# EAGLE design mc (EAGLE 9.6.2)
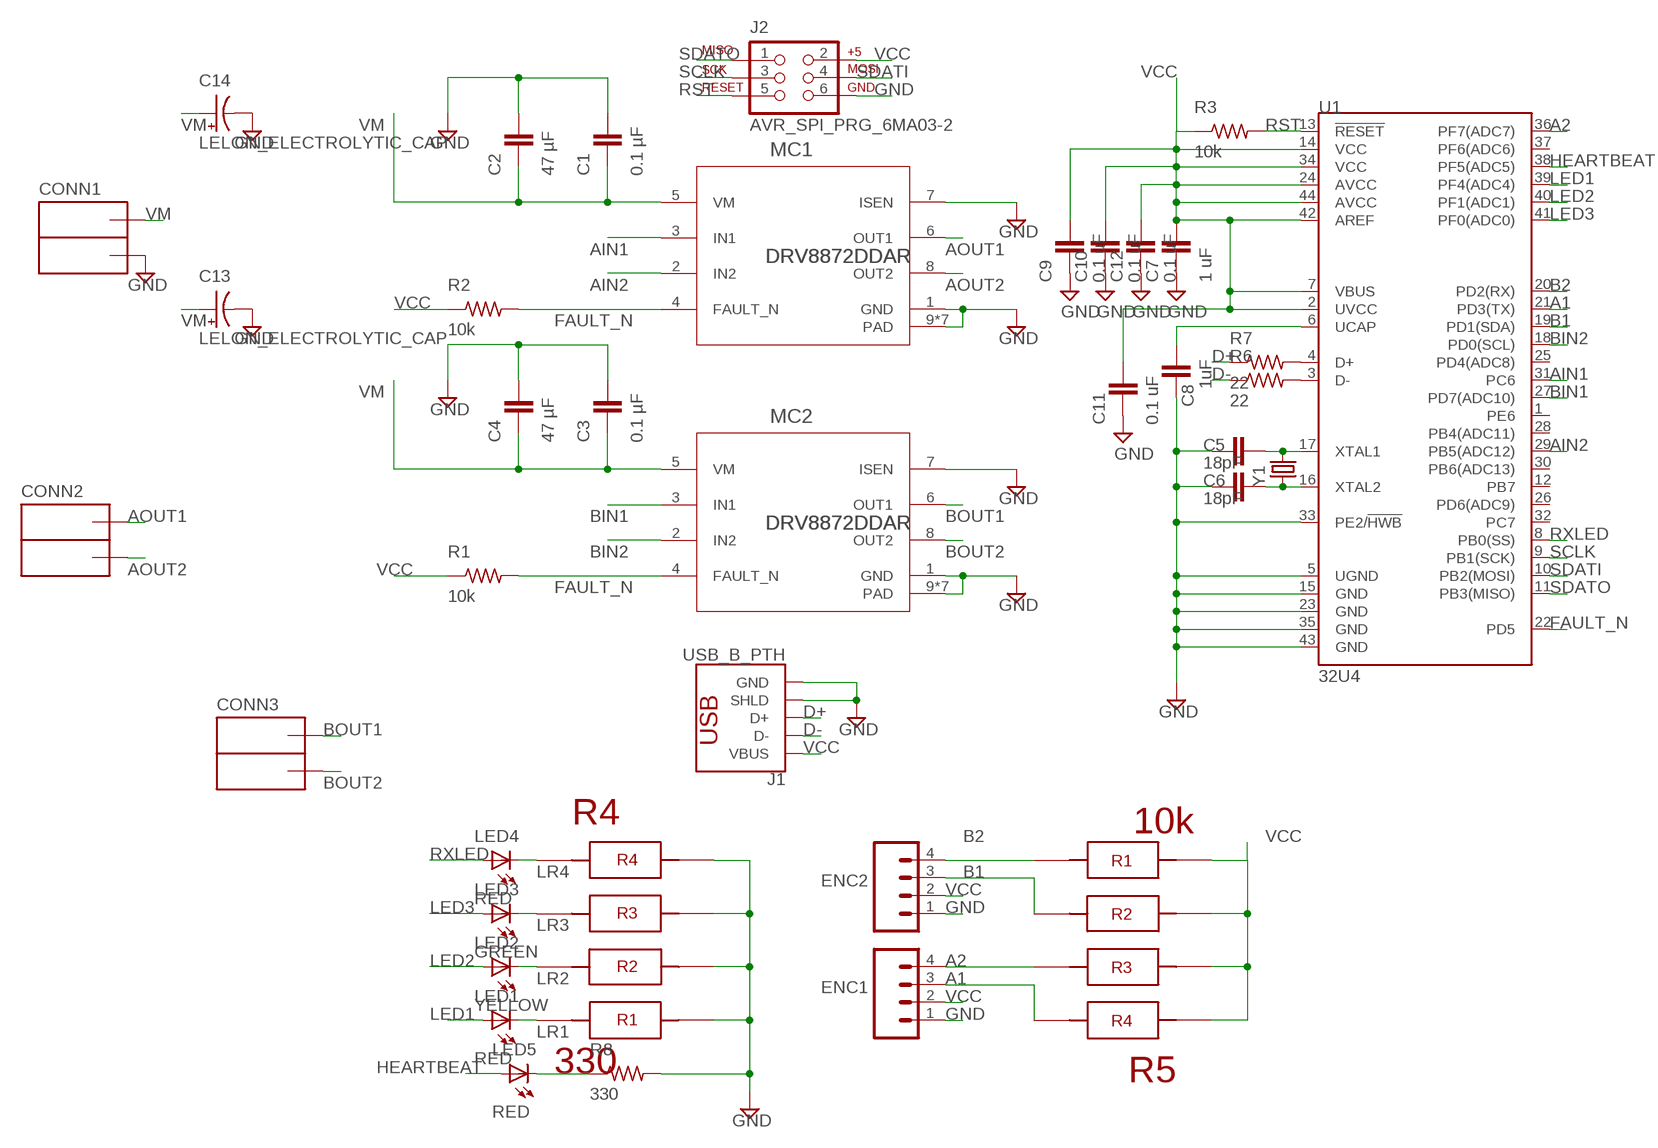
[diagram p0: schematic, sheet 1]

## Parts
C1  0.1 µF  CAP0603-CAP  [0603-CAP]
C2  47 µF  CAP1206  [1206]
C3  0.1 µF  CAP0603-CAP  [0603-CAP]
C4  47 µF  CAP1206  [1206]
C5  18pF  CAP0603-CAP  [0603-CAP]
C6  18pF  CAP0603-CAP  [0603-CAP]
C7  1 uF  CAP0603-CAP  [0603-CAP]
C8  1uF  CAP0603-CAP  [0603-CAP]
C9  0.1 uF  CAP0402-CAP  [0402-CAP]
C10  0.1 uF  CAP0402-CAP  [0402-CAP]
C11  0.1 uF  CAP0402-CAP  [0402-CAP]
C12  0.1 uF  CAP0402-CAP  [0402-CAP]
C13  LELON_ELECTROLYTIC_CAP  [LELON_CAP]
C14  LELON_ELECTROLYTIC_CAP  [LELON_CAP]
CONN1  ANDERSONVERTICAL  [ANDERSON_VERTICAL]
CONN2  ANDERSONVERTICAL  [ANDERSON_VERTICAL]
CONN3  ANDERSONVERTICAL  [ANDERSON_VERTICAL]
ENC1  M041X04-MTA  [1X04-MTA]
ENC2  M041X04-MTA  [1X04-MTA]
J1  USB_B_PTH  [USB-B-PTH]
J2  AVR_SPI_PRG_6MA03-2  [MA03-2]
LED1  RED  LED0805  [LED-0805]
LED2  YELLOW  LED0805  [LED-0805]
LED3  GREEN  LED0805  [LED-0805]
LED4  RED  LED0805  [LED-0805]
LED5  RED  LED0805  [LED-0805]
MC1  DRV8872DDAR  [DDA0008H_N_TEX]
MC2  DRV8872DDAR  [DDA0008H_N_TEX]
R1  10k  R-US_R0603  [R0603]
R2  10k  R-US_R0603  [R0603]
R3  10k  R-US_R0603  [R0603]
R4  330  4X-0603  [4X-0603]
R5  10k  4X-0603  [4X-0603]
R6  22  R-US_R0603  [R0603]
R7  22  R-US_R0603  [R0603]
R8  330  R-US_R0603  [R0603]
U1  32U4  ATMEGA32U4QFN  [QFN-44]
Y1  CRYSTAL  [CRYSTAL-SMD-5.0X3.2-2PIN]

## Nets
A1: ENC1.3 R5.4 U1.21(PD3(TX))
A2: ENC1.4 R5.3 U1.36(PF7(ADC7))
AIN1: MC1.3(IN1) U1.31(PC6)
AIN2: MC1.2(IN2) U1.29(PB5(ADC12))
AOUT1: CONN2.PIN2(OUTA) MC1.6(OUT1)
AOUT2: CONN2.PIN1(OUTB) MC1.8(OUT2)
B1: ENC2.3 R5.2 U1.19(PD1(SDA))
B2: ENC2.4 R5.1 U1.20(PD2(RX))
BIN1: MC2.3(IN1) U1.27(PD7(ADC10))
BIN2: MC2.2(IN2) U1.18(PD0(SCL))
BOUT1: CONN3.PIN2(OUTA) MC2.6(OUT1)
BOUT2: CONN3.PIN1(OUTB) MC2.8(OUT2)
D+: J1.D+ R7.1
D-: J1.D- R6.1
FAULT_N: MC1.4(FAULT_N) MC2.4(FAULT_N) R1.2 R2.2 U1.22(PD5)
GND: C1.2 C2.2 C3.2 C4.2 C5.1 C6.1 C7.1 C8.1 C9.1 C10.1 C11.1 C12.1 C13.P$2(-) C14.P$2(-) CONN1.PIN1(OUTB) ENC1.1 ENC2.1 J1.GND J1.SHLD1(SHLD) J1.SHLD2(SHLD) J2.6 MC1.1(GND) MC1.7(ISEN) MC1.9(PAD) MC1.P$1(PAD) MC1.P$2(PAD) MC1.P$3(PAD) MC1.P$4(PAD) MC1.P$5(PAD) MC1.P$6(PAD) MC2.1(GND) MC2.7(ISEN) MC2.9(PAD) MC2.P$1(PAD) MC2.P$2(PAD) MC2.P$3(PAD) MC2.P$4(PAD) MC2.P$5(PAD) MC2.P$6(PAD) R4.1 R4.2 R4.3 R4.4 R8.2 U1.5(UGND) U1.15(GND) U1.23(GND) U1.33(PE2/!HWB) U1.35(GND) U1.43(GND)
HEARTBEAT: LED5.A U1.38(PF5(ADC5))
LED1: LED1.A U1.39(PF4(ADC4))
LED2: LED2.A U1.40(PF1(ADC1))
LED3: LED3.A U1.41(PF0(ADC0))
LR1: LED1.C R4.8
LR2: LED2.C R4.7
LR3: LED3.C R4.6
LR4: LED4.C R4.5
N$1: C8.2 U1.6(UCAP)
N$3: C5.2 U1.17(XTAL1) Y1.P$2
N$6: R6.2 U1.3(D-)
N$9: R7.2 U1.4(D+)
N$10: LED5.C R8.1
N$13: C6.2 U1.16(XTAL2) Y1.P$1
RST: J2.5 R3.2 U1.13(!RESET)
RXLED: LED4.A U1.8(PB0(SS))
SCLK: J2.3 U1.9(PB1(SCK))
SDATI: J2.4 U1.10(PB2(MOSI))
SDATO: J2.1 U1.11(PB3(MISO))
VCC: C7.2 C9.2 C10.2 C11.2 C12.2 ENC1.2 ENC2.2 J1.VBUS J2.2 R1.1 R2.1 R3.1 R5.5 R5.6 R5.7 R5.8 U1.2(UVCC) U1.7(VBUS) U1.14(VCC) U1.24(AVCC) U1.34(VCC) U1.42(AREF) U1.44(AVCC)
VM: C1.1 C2.1 C3.1 C4.1 C13.P$1(+) C14.P$1(+) CONN1.PIN2(OUTA) MC1.5(VM) MC2.5(VM)
Unconnected: U1.1(PE6) U1.12(PB7) U1.25(PD4(ADC8)) U1.26(PD6(ADC9)) U1.28(PB4(ADC11)) U1.30(PB6(ADC13)) U1.32(PC7) U1.37(PF6(ADC6))

## Library data of the parts
C1 C3 C5-C12 = pie:CAP: Capacitor Standard 0603 ceramic capacitor, and 0.1" leaded capacitor.; PIE-INT-REF-NUM: CAPACITOR-GENERIC
C2 C4 = pie:CAP: Capacitor Standard 0603 ceramic capacitor, and 0.1" leaded capacitor.
C13 C14 = pie:LELON_ELECTROLYTIC_CAP
CONN1-CONN3 = pie:ANDERSON: 2-pin 25A Anderson Connector http://www.alliedelec.com/images/products/datasheets/bm/ANDERSON_POWER_PRODUCTS/70162018.pdf; PIE-INT-REF-NUM: Anderson
ENC1 ENC2 = pie:M04: 4-pin 0.1-inch header and MTA connector; PIE-INT-REF-NUM: MTA
J1 = pie:USB_B: USB Type B Connector SparkFun Products: SparkFun Stepoko <https://www.sparkfun.com/products/13899> PTH; PROD_ID: CONN-08278; SF_ID: PRT-00139
J2 = pie:AVR_SPI_PRG_6: AVR ISP 6 Pin This is the reduced ISP connector for AVR programming. Common on Arduino. This footprint will take up less PCB space and can be used with a 10-pin to 6-pin adapter such as SKU: BOB-08508; PIE-INT-REF-NUM: BULK-STOCK
LED1-LED5 = pie:LED: LEDs Standard schematic elements and footprints for 5mm, 3mm, 1206, and 0603 sized LEDs. 5mm - Spark Fun Electronics SKU : COM-00529 (and others); PIE-INT-REF-NUM: LED
MC1 MC2 = pie:DRV8872DDAR; BUILT_BY: Texas_Instrument_Team; MANUFACTURER_PART_NUMBER: DRV8872DDAR; SOURCELIBRARY: TI_2019-01-17; VENDOR: Texas Instruments
R1-R3 R6-R8 = pie:R-US_: RESISTOR, American symbol; DESCRIPTION: RESISTOR, American symbol; DISTRIBUTOR: DigiKey; MANUFACTURER: Rohm Semiconductor; NOTES: Cut Tape; PACKAGE: R0603; VALUE: >VALUE
R4 R5 = pie:4X-0603: 330: https://www.digikey.com/product-detail/en/panasonic-electronic-components/EXB-38V331JV/Y9331CT-ND/256586 10k: https://www.digikey.com/product-detail/en/panasonic-electronic-components/EXB-38V103JV/Y9103CT-ND/256604
U1 = pie:ATMEGA32U4: Atmel MCU, 32KByte Atmel 44-pin 8-bit Microcontroller with 32KBytes of ISP Flash and USB Controller Datasheet <http://cdn.sparkfun.com/datasheets/Dev/Arduino/Boards/ATMega32U4.pdf> SparkFun Products LilyPad Arduino USB - ATmega32U4 Board <https://www.sparkfun.com/products/12049> (DEV-12049) Pro Micro - 5V/16MHz <https://www.sparkfun.com/products/12640> (DEV-12640) Pro Micro - 3.3V/8MHz <https://www.sparkfun.com/products/12587> (DEV-12587) Fio v3 - ATmega32U4 <https://www.sparkfun.com/products/11520> (DEV-11520) Qduino Mini <https://www.sparkfun.com/products/13614> (DEV-13614) Makey Makey - Standard Kit <https://www.sparkfun.com/products/11511> (WIG-11511) Makey Makey Deluxe Kit <https://www.sparkfun.com/products/11519> (WIG-11519); PROD_ID: IC-10828
Y1 = pie:CRYSTAL: Various standard crystals. Proven footprints. Spark Fun Electronics SKU : COM-00534

## Board
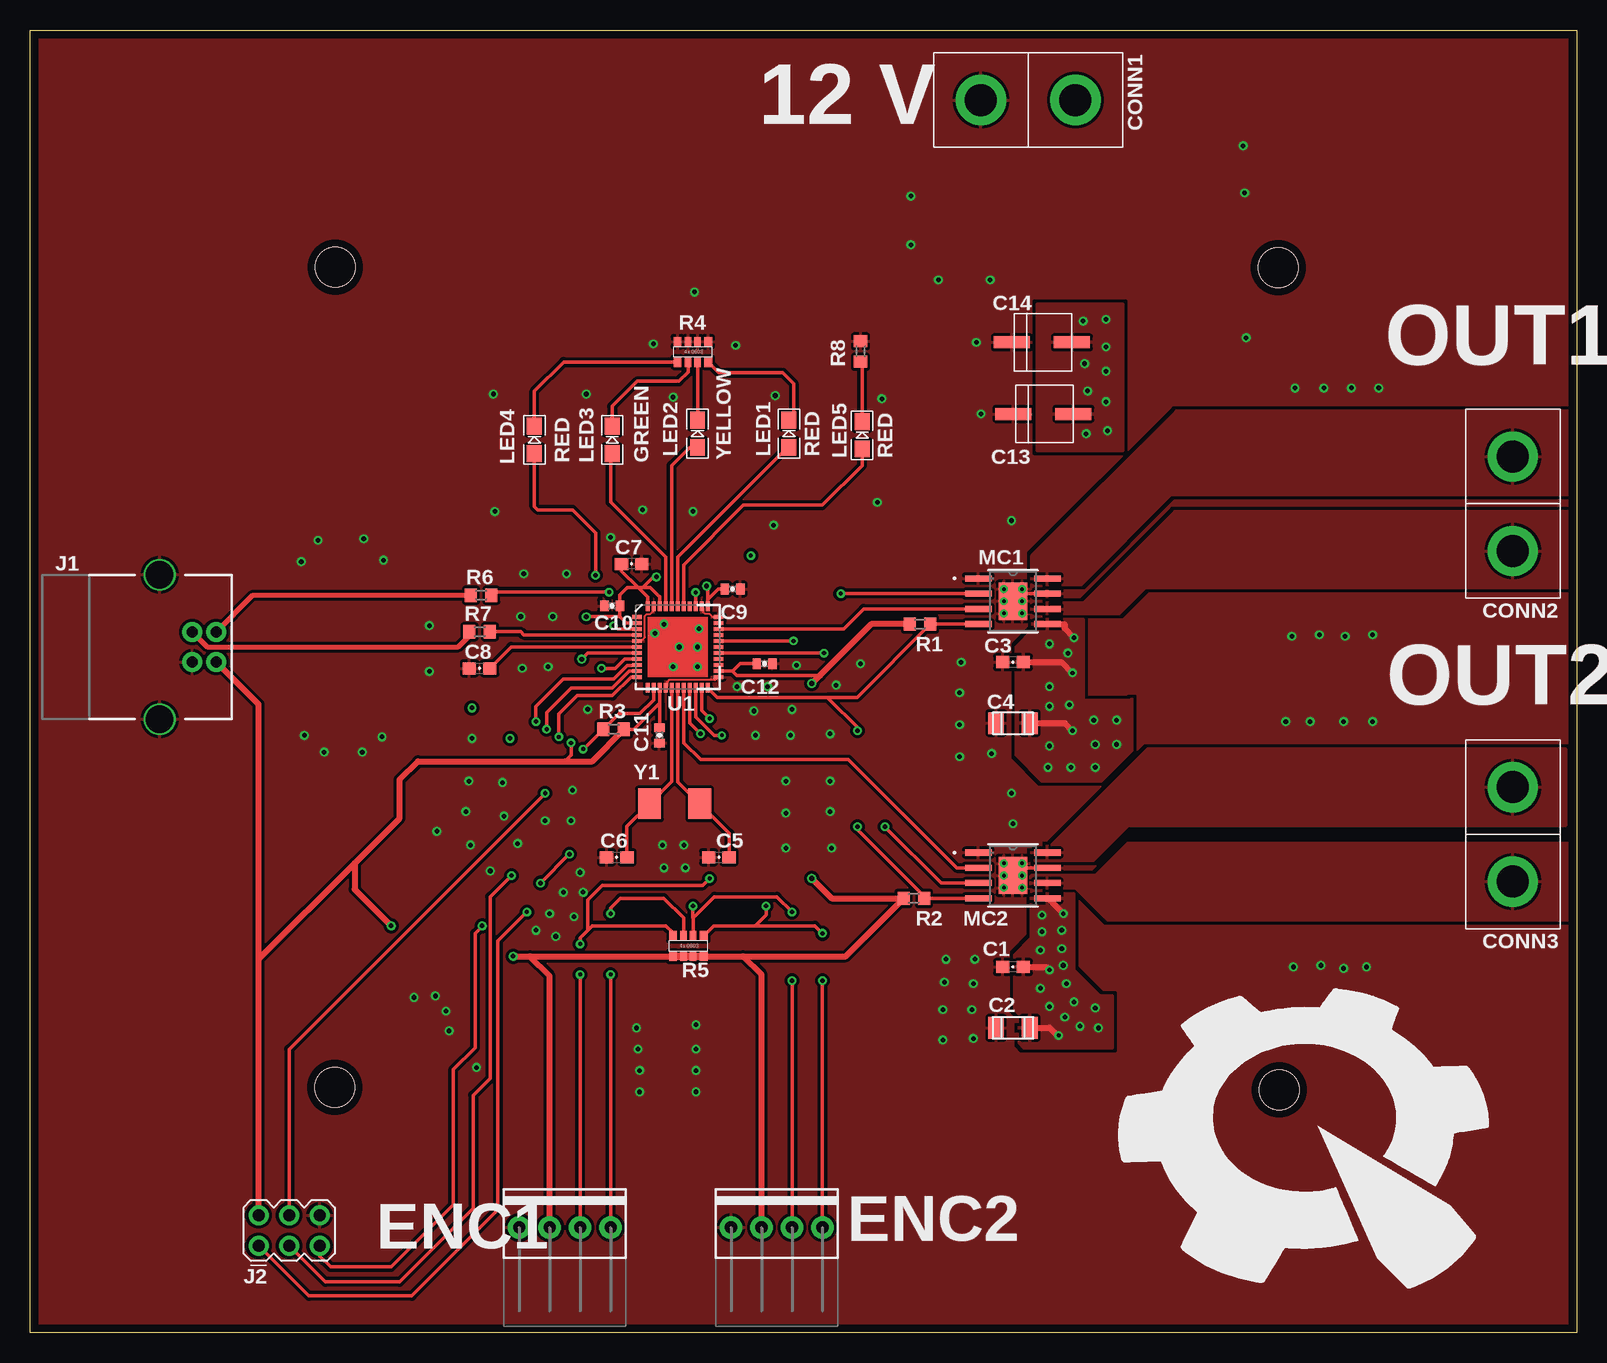
[diagram p1: board, top side]
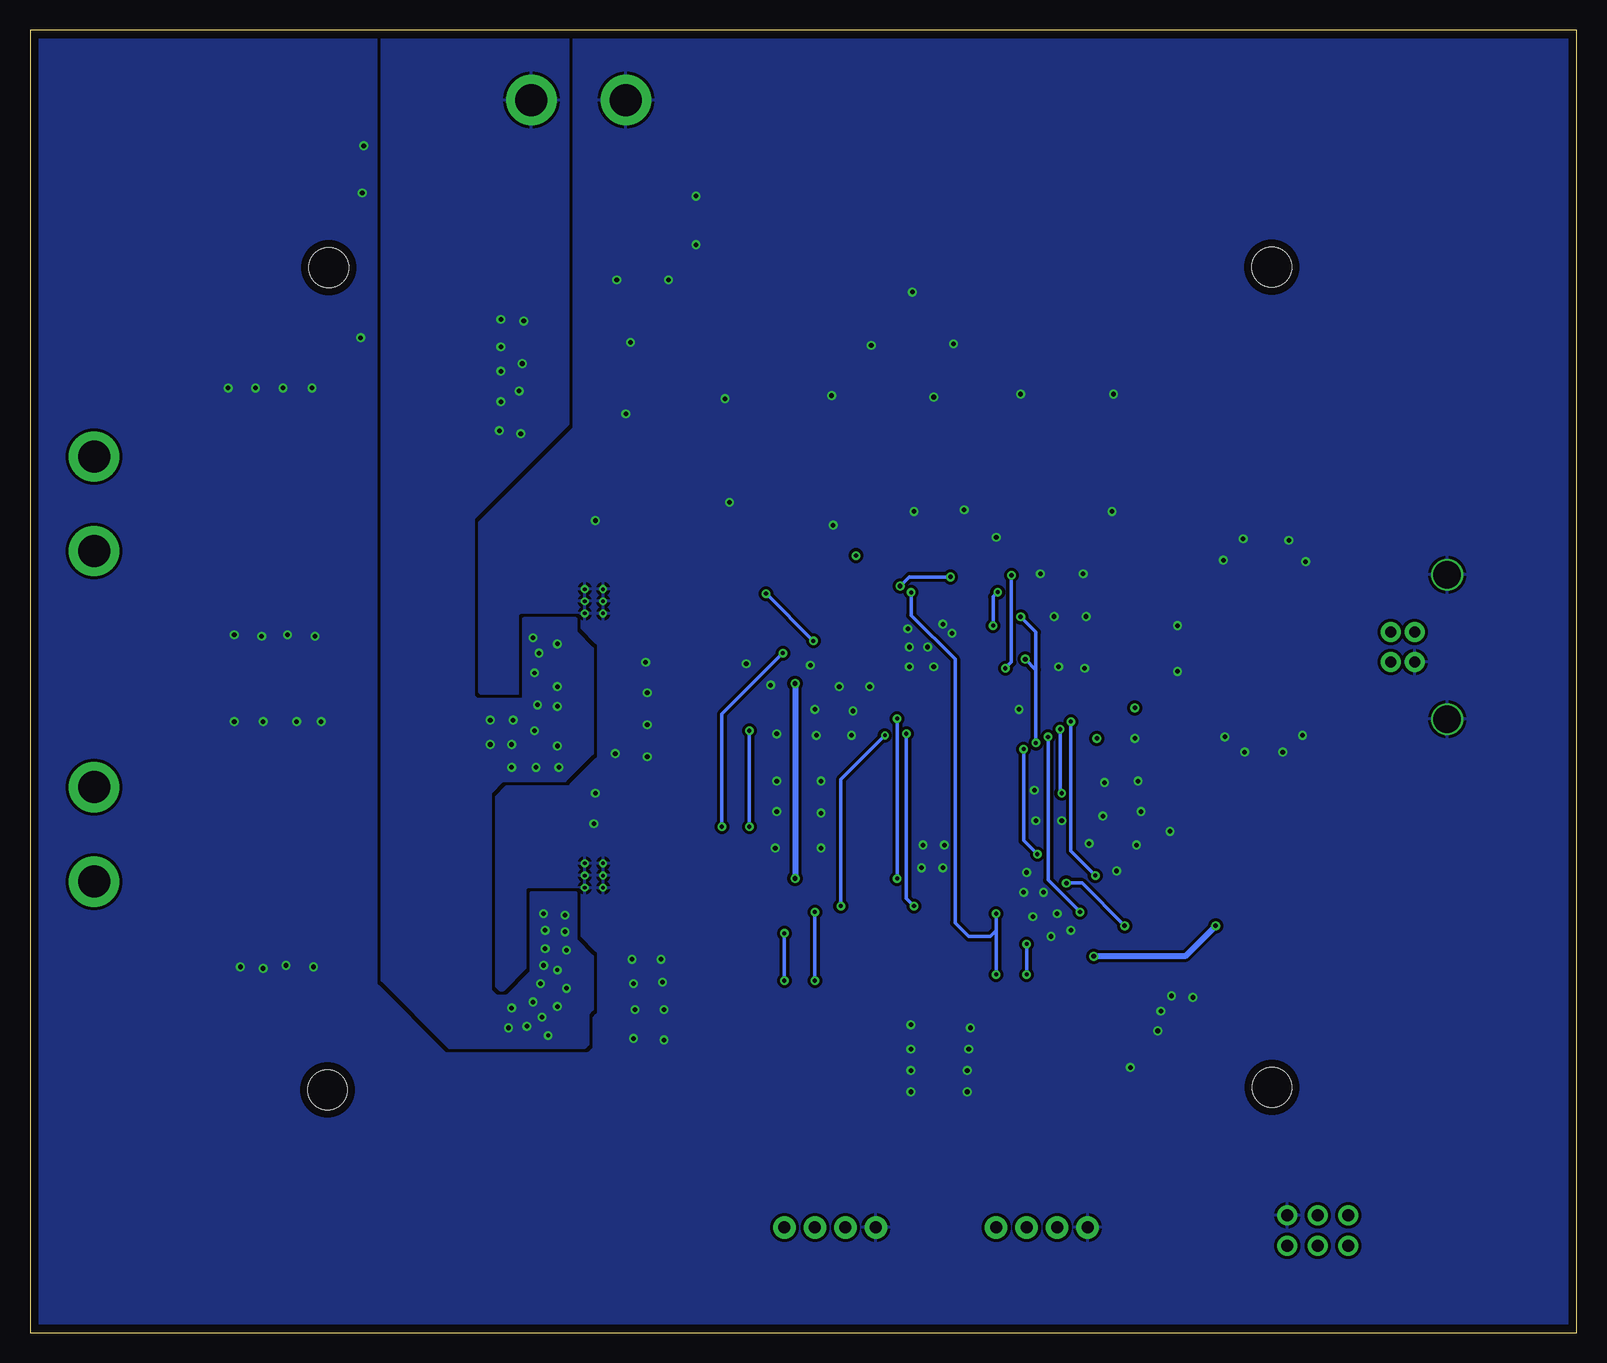
[diagram p2: board, bottom side, seen from below]

Size 128.91 x 108.58 mm. Coordinates in mm from the lower left corner, seen from the top.
Outline: 128.91,108.58 128.91,0 0,0 0,108.58 128.91,108.58
Copper layers (1*16): Top 2mil / dielectric 9mil / Bottom 2mil
Design rules "pie_jlc": minimum track width 6mil, minimum drill 0.199896875mm, track to track 6mil, track to pad 6mil, pad to pad 6mil, via to via 6mil, smd to smd 6mil, copper to edge 25mil, drill to drill 7mil, minimum pad ring 7mil, minimum via ring 7mil, stop-mask expansion 3mil, vias tented up to drill 21mil, thermal gap 10mil

### Footprints (pad centres in the part's own frame; a part is rotated, then mirrored left to right if it is on the bottom)
0603-CAP = smd 1.1 x 1: 1 -0.85,0; 2 0.85,0
1206 = smd 1.306 x 1.8: 1 -1.403,0; 2 1.403,0
0402-CAP = smd 0.7 x 0.9: 1 -0.65,0; 2 0.65,0
LELON_CAP = smd 3 x 1: P$1 -3,0; P$2 2,0
ANDERSON_VERTICAL = drill 2.667 pad 4.191: PIN1 0,-3.937; PIN2 0,3.937
1X04-MTA = drill 1.016 pad 1.88: 1 -3.81,0; 2 -1.27,0; 3 1.27,0; 4 3.81,0
USB-B-PTH = drill 0.914 pad 1.676: D+ 4,1.25; D- 5.981,1.25; GND 4,-1.25; VBUS 5.981,-1.25 | drill 2.286: SHLD1 1.282,-6.02; SHLD2 1.282,6.02
MA03-2 = drill 1 pad 1.676: 1 -2.54,-1.27; 2 -2.54,1.27; 3 0,-1.27; 4 0,1.27; 5 2.54,-1.27; 6 2.54,1.27
LED-0805 = smd 1.397 x 1.245: A -1.143,0; C 1.143,0
DDA0008H_N_TEX = smd 2.21 x 0.508: 1 -2.875,1.905; 2 -2.875,0.635; 3 -2.875,-0.635; 4 -2.875,-1.905; 5 2.875,-1.905; 6 2.875,-0.635; 7 2.875,0.635; 8 2.875,1.905 | smd 2.388 x 3.099: 9 0,0 | drill 0.3: P$1 -0.762,1.016; P$2 0.762,1.016; P$3 -0.762,0; P$4 0.762,0; P$5 -0.762,-1.016; P$6 0.762,-1.016
R0603 = smd 1 x 1.1: 1 -0.85,0; 2 0.85,0
4X-0603 = smd 0.65 x 0.8: 1 0,-0.05; 4 2.55,-0.05; 5 2.55,1.65; 8 0,1.65 | smd 0.55 x 0.8: 2 0.875,-0.05; 3 1.675,-0.05; 6 1.675,1.65; 7 0.875,1.65
QFN-44 = smd 0.8 x 0.3: 1 -3.4,2.5; 2 -3.4,2; 3 -3.4,1.5; 4 -3.4,1; 5 -3.4,0.5; 6 -3.4,0; 7 -3.4,-0.5; 8 -3.4,-1; 9 -3.4,-1.5; 10 -3.4,-2; 11 -3.4,-2.5; 23 3.4,-2.5; 24 3.4,-2; 25 3.4,-1.5; 26 3.4,-1; 27 3.4,-0.5; 28 3.4,0; 29 3.4,0.5; 30 3.4,1; 31 3.4,1.5; 32 3.4,2; 33 3.4,2.5 | smd 0.3 x 0.8: 12 -2.5,-3.4; 13 -2,-3.4; 14 -1.5,-3.4; 15 -1,-3.4; 16 -0.5,-3.4; 17 0,-3.4; 18 0.5,-3.4; 19 1,-3.4; 20 1.5,-3.4; 21 2,-3.4; 22 2.5,-3.4; 34 2.5,3.4; 35 2,3.4; 36 1.5,3.4; 37 1,3.4; 38 0.5,3.4; 39 0,3.4; 40 -0.5,3.4; 41 -1,3.4; 42 -1.5,3.4; 43 -2,3.4; 44 -2.5,3.4
STAND-OFF = hole 3.302: 0,0
CRYSTAL-SMD-5.0X3.2-2PIN = smd 1.905 x 2.54: P$1 -2.095,0; P$2 2.095,0

### Placement (x,y rotation side)
C1  81.92,30.48 180 top
C2  81.92,25.4 180 top
C3  81.92,55.88 180 top
C4  81.92,50.8 180 top
C5  57.4,39.62 0 top
C6  48.9,39.62 0 top
C7  50.14,64.08 180 top
C8  37.47,55.37 0 top
C9  58.55,61.98 180 top
C10  48.51,60.58 0 top
C11  52.45,49.78 90 top
C12  61.21,55.75 180 top
C13  83.95,76.58 180 top
C14  83.82,82.55 180 top
CONN1  83.19,102.74 270 top
CONN2  123.57,69.09 180 top
CONN3  123.57,41.53 180 top
ENC1  44.58,8.76 0 top
ENC2  62.23,8.76 0 top
J1  9.53,57.15 0 top
J2  21.59,8.51 0 top
LED1  63.25,74.93 90 top
LED2  55.63,74.93 90 top
LED3  48.51,74.42 90 top
LED4  42.04,74.42 90 top
LED5  69.34,74.8 90 top
MC1  81.92,60.96 0 top
MC2  81.92,38.1 0 top
R1  74.17,59.05 0 top
R2  73.66,36.2 0 top
R3  48.64,50.29 180 top
R4  56.52,82.55 180 top
R5  56.13,33.02 180 top
R6  37.59,61.47 0 top
R7  37.47,58.42 0 top
R8  69.22,81.79 90 top
U1  53.98,57.15 0 top
U$1  [STAND-OFF]  25.4,20.45 0 top
U$2  [STAND-OFF]  104.11,20.24 0 top
U$3  [STAND-OFF]  104.01,88.77 0 top
U$4  [STAND-OFF]  25.43,88.82 0 top
U$5  [PIE-LOGO]  107.19,17.02 0 top
Y1  53.72,44.07 0 top

### Tracks (layer width: path | path; a pad name or v marks a point on that pad's centre or on a via)
A1  (via drill 0.35 pad 0.33)
  Top 0.305: R5.4 53.58,33.32 53,33.91 46.86,33.91 46.48,33.53 | 46.48,33.53 45.85,32.89 v45.85,32.38 | ENC1.3 v45.85,29.84 | U1.21 55.98,51.84 v56.64,51.18 | 46.48,33.53 46.48,36.07 47.7,37.29 56.08,37.29 v56.64,37.85
  Bottom 0.305: v45.85,32.38 v45.85,29.84 | v56.64,51.18 v56.64,37.85
A2  (via drill 0.35 pad 0.33)
  Top 0.305: R5.3 54.46,34.57 52.83,36.2 49.17,36.2 48.39,35.41 v48.39,34.92 | ENC1.4 v48.39,29.84 | U1.36 v55.48,61.7 v55.47,61.7
  Bottom 0.305: v48.39,34.92 48.39,33.53 | 48.39,33.53 v48.39,29.84 | v55.47,61.7 55.47,59.79 51.82,56.13 51.82,34.16 50.67,33.02 48.9,33.02 48.39,33.53
AIN1
  Top 0.305: U1.31 67.79,58.65 69.47,60.33 MC1.3
AIN2  (via drill 0.35 pad 0.33)
  Top 0.305: U1.29 63.62,57.65 v63.63,57.66 | MC1.2 v67.56,61.59
  Bottom 0.305: v63.63,57.66 v67.56,61.59
AOUT1
  pour Top: 83.44,60.71 83.44,59.94 90.81,59.94 92.96,62.1 130.05,62.1 130.05,68.45 95.38,68.45 87.76,60.83 83.57,60.83
AOUT2
  pour Top: 83.44,64.77 83.44,62.48 83.57,62.36 87.63,62.36 95.12,69.85 130.05,69.85 130.05,76.83 95.5,76.83
B1  (via drill 0.35 pad 0.33)
  Top 0.305: R5.2 55.26,34.56 | v63.5,35.05 62.23,36.32 57.02,36.32 55.26,34.56 | v63.5,29.34 ENC2.3 | U1.19 54.98,50.82 v55.88,49.91 | 55.26,34.56 55.24,34.57 v55.24,35.56
  Bottom 0.305: v63.5,35.05 v63.5,29.34 | v55.88,49.91 55.88,36.2 v55.24,35.56
B2  (via drill 0.3 pad 0.33, 0.35 pad 0.33)
  Top 0.305: R5.1 56.97,33.91 60.45,33.91 | v66.04,33.27 65.41,33.91 60.45,33.91 | v66.04,29.34 ENC2.4 | 60.45,33.91 61.34,34.8 v61.34,35.56 | U1.20 55.47,51.33 57.02,49.78 v57.66,49.78
  Bottom 0.305: v66.04,33.27 v66.04,29.34 | v61.34,35.56 61.34,46.1 v57.66,49.78
BIN1  (via drill 0.35 pad 0.33)
  Top 0.305: U1.27 v66.16,56.65 v66.17,56.64 | v71.25,42.16 75.95,37.47 MC2.3
  Bottom 0.305: v66.17,56.64 71.25,51.56 v71.25,42.16
BIN2
  Top 0.305: U1.18 54.48,49.16 55.88,47.75 68.2,47.75 77.22,38.73 MC2.2
BOUT1
  pour Top: 83.31,37.97 83.31,37.08 87.12,37.08 89.79,34.42 128.78,34.42 128.78,40.77 91.44,40.77 88.77,38.1 83.44,38.1
BOUT2
  pour Top: 83.44,40.39 83.44,39.62 83.69,39.37 88.65,39.37 91.57,42.29 128.02,42.29 128.02,48.64 93.09,48.64 84.96,40.51 83.57,40.51
D+
  Top 0.203: 36.62,58.08 R7.1
  Top 0.406: J1.D+ 14.78,57.15 35.69,57.15 36.62,58.08
D-
  Top 0.406: J1.D- 18.57,61.47 R6.1
FAULT_N  (via drill 0.35 pad 0.33)
  Top 0.305: U1.22 57.27,52.96 66.55,52.96 | 66.55,52.96 68.92,52.96 R1.2 MC1.4 | R2.2 74.68,36.2 | 74.68,36.2 MC2.4 | 74.68,36.2 68.96,41.91 v68.96,42.16 | 66.55,52.96 66.55,52.83 68.96,50.42 v68.96,50.16
  Bottom 0.305: v68.96,50.16 v68.96,42.16
GND  (via drill 0.38 pad 0.33)
  Top 0.152: U1.33 56.88,59.65 56.6,59.92 56.23,59.92 56.09,60.06 56.09,60.43 U1.35 | U1.5 50.69,57.77 51.07,57.77 51.25,57.95 51.25,59.74 51.38,59.88 51.68,59.88 51.98,60.18 U1.43 | U1.23 57.1,54.38 53.23,54.38 53.09,54.24 53.09,53.87 U1.15
  Top 0.305: MC1.9 82.55,61.59 MC1.7 | MC2.9 82.55,38.73 MC2.7
  other vias: 112.39,78.74 110.11,78.74 107.82,78.74 105.41,78.74 105.16,58.04 107.44,58.17 109.6,58.04 111.89,58.17 111.89,50.93 109.47,50.93 106.68,50.93 104.65,50.93 105.28,30.48 107.57,30.61 109.47,30.35 111.38,30.48 78.74,31.11 78.61,29.08 78.49,26.92 78.61,24.51 76.07,24.38 76.07,26.92 76.2,29.21 76.33,31.11 81.92,42.42 81.79,44.96 80.14,48.26 77.47,48.01 77.47,50.67 77.47,53.34 77.6,55.88 81.79,67.69 79.25,76.58 78.87,82.55 80.01,87.76 75.69,87.76 73.41,90.68 73.41,94.74 101.09,98.93 101.22,95 101.35,82.93 51.94,82.42 55.37,86.74 58.8,82.3 38.61,78.23 46.35,78.23 53.59,77.98 62.1,78.11 70.99,77.85 70.61,69.22 61.98,67.31 55.24,68.45 51.05,68.58 48.39,66.29 38.73,68.45 66.67,49.91 66.67,45.97 66.67,43.43 66.8,40.39 62.99,40.39 62.99,43.31 62.99,45.97 63.37,49.78 60.45,49.78 63.88,55.63 67.18,53.98 69.22,55.75 63.5,51.94 60.33,51.82 52.7,40.64 54.48,40.64 54.61,38.73 52.83,38.73 45.85,38.35 44.45,36.7 43.31,34.92 42.16,33.53 43.81,33.02 45.34,34.67 46.1,36.7 42.93,42.67 45.09,42.67 45.21,45.21 40.64,40.77 38.35,38.48 36.7,40.64 39.5,43.05 39.37,45.85 36.58,45.97 36.32,43.43 33.91,41.78 36.83,49.53 43.18,55.5 41.02,55.37 46.48,51.94 43.56,59.69 40.89,59.69 44.7,63.25 41.15,63.25 24.51,48.39 27.69,48.39 24,66.04 27.81,66.17 29.46,64.39 22.61,64.26 22.86,49.78 29.34,49.66 32,27.94 33.78,28.07 34.67,26.8 34.92,25.15 37.21,22.1 55.5,25.65 55.5,23.62 55.5,21.84 55.5,20.07 50.8,20.07 50.8,21.84 50.67,23.62 50.55,25.4 33.27,58.93 33.27,55.12 58.93,53.85 61.47,53.85 55.75,58.67 52.83,59.05 52.07,58.29 53.59,55.5 55.63,55.5 55.63,57.15 54.1,57.15
  pour Top (isolate 0.254, rank 2): -4.45,127.51 153.29,127.51 153.29,-4.7 -4.45,-4.7
  pour Bottom (isolate 0.254, rank 2): -7.62,122.3 147.83,122.3 147.83,-7.11 -7.62,-7.11
HEARTBEAT
  Top 0.305: U1.38 54.48,64 59.44,68.96 66.02,68.96 69.34,72.29 LED5.A
LED1
  Top 0.305: U1.39 53.98,64.67 63.09,73.79 LED1.A
LED2
  Top 0.305: U1.40 53.48,72.28 54.98,73.79 LED2.A
LED3
  Top 0.305: U1.41 52.98,64.63 48.39,69.22 48.39,73.15 LED3.A
LR1
  Top 0.305: R4.8 57.41,80.01 62.74,80.01 63.63,79.12 63.63,76.45 LED1.C
LR2
  Top 0.305: R4.7 55.63,80.89 LED2.C
LR3
  Top 0.305: LED3.C 48.51,77.22 50.6,79.31 54.08,79.31 54.84,80.07 R4.6
LR4
  Top 0.305: LED4.C 42.04,78.46 44.48,80.9 R4.5
N$1
  Top 0.305: C8.2 40.09,57.15 U1.6
N$2  (via drill 0.35)
  other vias: 60.07,64.77
N$3
  Top 0.305: U1.17 53.98,45.91 Y1.P$2 58.27,41.61 58.27,39.64 C5.2
N$6  (via drill 0.35 pad 0.33)
  Top 0.305: v48.26,61.72 38.7,61.72 R6.2 | U1.3 48.99,58.65 48.72,58.93 v48.64,58.93
  Bottom 0.305: v48.26,61.72 48.64,61.34 v48.64,58.93
N$9
  Top 0.305: R7.2 40.89,58.42 41.16,58.15 U1.4
N$10
  Top 0.305: LED5.C 69.34,80.81 R8.1
N$13
  Top 0.305: U1.16 53.48,45.92 Y1.P$1 49.74,42.19 C6.2
N$161  (via drill 0.38 pad 0.33)
  other vias: 40.01,49.53
N$163  (via drill 0.38 pad 0.33)
  other vias: 36.83,52.07
RST  (via drill 0.35 pad 0.33, 0.38 pad 0.33)
  Top 0.305: U1.13 51.98,52.73 50.83,51.59 49.09,51.59 R3.2 46.14,48.64 v46.1,48.64 | v37.68,33.91 37.68,33.87 37.08,33.27 37.08,23.75 35.28,21.95 35.28,10.64 30.1,5.46 25.04,5.46 24.13,6.38 J2.5 | v42.55,37.47 v44.96,39.88
  Bottom 0.305: v44.96,39.88 46.1,41.02 v46.1,48.64 | v37.68,33.91 41.24,37.47 v42.55,37.47
RXLED  (via drill 0.35 pad 0.33)
  Top 0.305: v47.12,63.12 47.12,63.37 47.14,63.4 47.14,66.65 45.21,68.58 42.31,68.58 42.04,68.86 LED4.A | v47.62,55.37 48.77,55.37 49.55,56.15 U1.8
  Bottom 0.305: v47.62,55.37 47.12,55.88 v47.12,63.12
SCLK  (via drill 0.35 pad 0.33)
  Top 0.305: U1.9 50.55,55.63 49.78,55.63 48.64,54.48 44.45,54.48 42.16,52.2 v42.16,50.93 | v40.13,38.1 38.35,36.32 38.35,21.21 36.93,19.79 36.93,10.34 30.81,4.22 24.61,4.22 J2.3
  Bottom 0.305: v42.16,50.93 42.16,40.13 v40.13,38.1
SDATI  (via drill 0.35 pad 0.33)
  Top 0.305: U1.10 49.95,55.15 48.53,53.72 45.09,53.72 43.05,51.69 v43.05,50.29 | v42.93,44.96 21.59,23.62 J2.4
  Bottom 0.305: v43.05,50.29 43.05,45.09 v42.93,44.96
SDATO  (via drill 0.35 pad 0.33)
  Top 0.305: U1.11 50.1,54.65 48.54,53.09 45.6,53.09 44.07,51.55 v44.07,49.66 | v41.4,35.05 38.99,32.64 38.99,10.21 31.83,3.05 23.24,3.05 J2.1
  Bottom 0.305: v44.07,49.66 44.07,37.72 v41.4,35.05
VCC  (via drill 0.35 pad 0.33, 0.38 pad 0.33, 0.4 pad 0.33)
  Top 0.254: U1.7 50.57,56.64
  Top 0.305: R3.1 50.29,50.29 52.48,52.48 | 52.48,52.48 U1.14 | v45.97,56.13 46.48,56.64 50.57,56.64 | v45.09,49.15 45.09,48.13 44.58,47.62 | U1.2 49.69,59.15 49.15,59.69 | 65.82,54.77 58.9,54.77 58.52,55.15 | U1.24 58.52,55.15 | U1.42 52.48,61.34 52.45,61.34 51.69,62.1 51.05,62.1 | 51.05,62.1 50.67,62.1 | 50.67,62.1 49.78,62.1 49.15,61.47 49.15,60.59 C10.2 49.15,60.56 49.15,59.69 | 50.67,62.1 51.48,61.3 U1.44 | 51.05,62.1 51.94,62.99 v52.2,62.99 | v56.39,62.23 56.48,62.14 56.48,61.09 | 56.48,61.09 U1.34 | 49.15,59.69 46.35,59.69 v46.35,59.66 | 56.48,61.09 57.36,61.98 C9.2 | 52.48,52.48 52.48,50.46 C11.2 | 58.52,55.15 58.58,55.15 59.18,55.75 C12.2 | C7.2 49.29,63.49 50.67,62.1
  Top 0.508: 41.66,31.37 R5.5 | R5.8 59.44,31.37 | 59.44,31.37 67.98,31.37 R2.1 66.8,36.2 v65.15,37.85 | ENC1.2 43.31,29.72 41.66,31.37 | ENC2.2 60.96,29.84 59.44,31.37 | R1.1 70.1,59.05 65.82,54.77 v65.15,54.1 | R3.1 49.49,50.25 46.86,47.62 44.58,47.62 32.33,47.62 30.81,46.1 30.81,42.88 27.05,39.12 | 27.05,39.12 27.05,36.96 v30.1,33.91 | v40.26,31.37 41.65,31.37 41.66,31.37 | 27.05,39.12 19.02,31.09 | 19.02,31.09 19.02,9.8 J2.2 | 19.02,31.09 19.02,52.38 J1.VBUS
  Top 0.61: R5.5 R5.6 R5.7 R5.8
  Bottom 0.305: v45.97,56.13 45.09,55.24 | v45.09,49.15 45.09,55.24 | 45.09,55.24 45.09,58.4 v46.35,59.66 | v52.2,62.99 55.63,62.99 v56.39,62.23
  Bottom 0.508: v65.15,54.1 v65.15,37.85 | v30.1,33.91 32.64,31.37 v40.26,31.37
VM  (via drill 0.35 pad 0.33, 0.38 pad 0.33)
  Top 0.508: MC1.5 86.21,59.05 86.21,58.73 87,57.95 v87,57.91 | C3.1 85.98,55.88 v86.87,54.99 | C4.1 86.23,50.8 v86.87,50.16 | MC2.5 84.84,36.2 v86.11,34.92 | C1.1 84.71,30.48 v84.96,30.23 | C2.1 84.96,25.4 85.6,24.77 v85.72,24.77
  other vias: 85.98,33.53 84.33,34.8 84.33,33.4 84.2,31.88 85.98,32 86.36,29.08 84.2,28.7 84.96,27.18 87,27.56 88.77,27.05 89.03,25.4 87.5,25.53 86.23,26.29 86.11,30.61 89.66,84.45 89.66,82.17 89.66,80.14 89.66,77.6 89.79,75.18 88.77,47.12 86.74,47.12 84.84,47.12 84.96,48.9 88.77,49.02 90.55,49.02 90.55,51.05 88.65,51.05 86.61,52.32 84.96,53.85 84.96,57.4 84.96,52.2 86.49,56.64 87.76,84.33 87.88,80.77 88.14,78.49 88.01,74.93
  pour Bottom: 83.44,59.56 83.44,58.42 82.04,57.02 82.04,48.26 84.33,45.97 89.53,45.97 90.55,44.96 90.55,28.57 90.04,28.07 89.15,28.07 87.12,30.1 87.12,36.7 83.44,36.7 83.44,32.77 82.04,31.37 82.04,26.92 82.42,26.54 82.42,24 82.68,23.75 93.98,23.75 99.57,29.34 99.57,108.08 84.07,108.08 84.07,75.69 91.95,67.82 91.95,53.09 91.69,52.83 87.76,52.83 87.76,59.56
  pour Top: 83.44,59.44 87.76,59.44 87.76,52.7 91.69,52.7 91.82,52.83 91.82,48.51 89.28,45.97 84.33,45.97 82.17,48.13 82.17,57.15 83.57,58.55 83.57,59.31
  pour Top: 83.95,85.72 91.06,85.72 91.06,73.53 83.95,73.53
  pour Top: 83.44,36.58 87,36.58 87,30.23 89.15,28.07 90.17,28.07 90.17,23.75 82.8,23.75 82.42,24.13 82.42,26.54 82.04,26.92 82.04,31.5 83.44,32.89

### Text on the board
tPlace: 12 V | OUT1 | OUT2